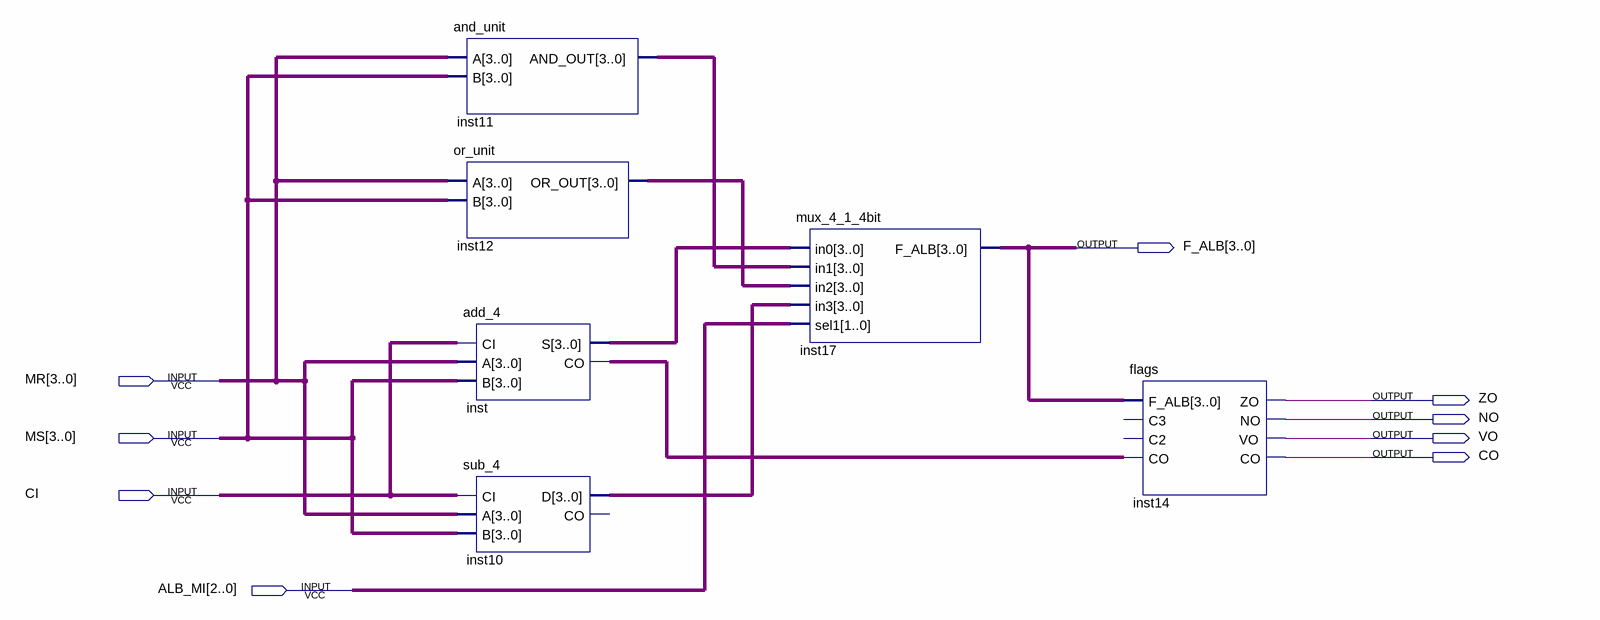
[diagram p0: schematic sheet]
// Quartus schematic ALB.bdf as structural Verilog: 6 symbols, 9 pins
module ALB (
  input  [3:0] MR,
  input  [3:0] MS,
  input  CI,
  input  [2:0] ALB_MI,
  output [3:0] F_ALB,
  output ZO,
  output NO,
  output VO,
  output CO
);

  wire inst_co;
  wire [3:0] inst10_d, inst11_and_out, inst12_or_out, inst_s;

  and_unit inst11 (.A(MR), .B(MS), .AND_OUT(inst11_and_out));
  or_unit inst12 (.A(MR), .B(MS), .OR_OUT(inst12_or_out));
  add_4 inst (.CI(CI), .A(MR), .B(MS), .S(inst_s), .CO(inst_co));
  sub_4 inst10 (.CI(CI), .A(MR), .B(MS), .D(inst10_d));  // open: CO
  mux_4_1_4bit inst17 (
    .in0(inst_s), .in1(inst11_and_out), .in2(inst12_or_out), .in3(inst10_d), .sel1(ALB_MI), .F_ALB(F_ALB));
  flags inst14 (.F_ALB(F_ALB), .CO({inst_co, CO}), .ZO(ZO), .NO(NO), .VO(VO));  // open: C3, C2
endmodule
